# Altium project Dev_BRD_STM32F030K6T6.PrjPcb
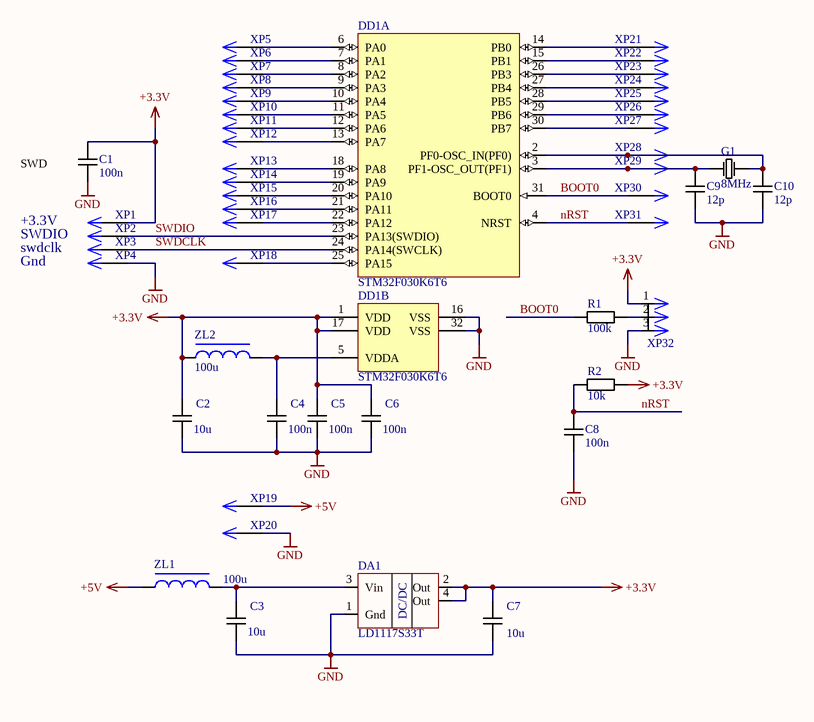
[diagram p0: Dev_BRD_STM32F030K6T6.SchDoc]
1 sheet, 49 parts. Net scope: global (net labels, ports and power ports of the same name join across sheets).
Board files: Dev_BRD_STM32F030K6T6.PcbDoc, Copy of Dev_BRD_STM32F030K6T6_ширина20.PcbDoc

## Sheet Dev_BRD_STM32F030K6T6.SchDoc
size A4 portrait

### Parts
C1  100n  [CAPC1608(0603)N]
C2  10u  [CAPC1608(0603)N]
C3  10u  [CAPC1608(0603)N]
C4  100n  [CAPC1608(0603)N]
C5  100n  [CAPC1608(0603)N]
C6  100n  [CAPC1608(0603)N]
C7  10u  [CAPC1608(0603)N]
C8  100n  [CAPC1608(0603)N]
C9  12p  [CAPC1608(0603)N]
C10  12p  [CAPC1608(0603)N]
DA1  LD1117S33T  [SOT223_M]
DD1  STM32F030K6T6  [STM-LQFP32_M]  (parts A,B of 2)
G1  8MHz  [HC-49/S]
R1  100k  [RESC1608(0603)N]
R2  10k  [RESC1608(0603)N]
XP1  PLS-1  [PLS-1-3D]  (value not drawn)
XP2  PLS-1  [PLS-1-3D]  (value not drawn)
XP3  PLS-1  [PLS-1-3D]  (value not drawn)
XP4  PLS-1  [PLS-1-3D]  (value not drawn)
XP5  PLS-1  [PLS-1-3D]  (value not drawn)
XP6  PLS-1  [PLS-1-3D]  (value not drawn)
XP7  PLS-1  [PLS-1-3D]  (value not drawn)
XP8  PLS-1  [PLS-1-3D]  (value not drawn)
XP9  PLS-1  [PLS-1-3D]  (value not drawn)
XP10  PLS-1  [PLS-1-3D]  (value not drawn)
XP11  PLS-1  [PLS-1-3D]  (value not drawn)
XP12  PLS-1  [PLS-1-3D]  (value not drawn)
XP13  PLS-1  [PLS-1-3D]  (value not drawn)
XP14  PLS-1  [PLS-1-3D]  (value not drawn)
XP15  PLS-1  [PLS-1-3D]  (value not drawn)
XP16  PLS-1  [PLS-1-3D]  (value not drawn)
XP17  PLS-1  [PLS-1-3D]  (value not drawn)
XP18  PLS-1  [PLS-1-3D]  (value not drawn)
XP19  PLS-1  [PLS-1-3D]  (value not drawn)
XP20  PLS-1  [PLS-1-3D]  (value not drawn)
XP21  PLS-1  [PLS-1-3D]  (value not drawn)
XP22  PLS-1  [PLS-1-3D]  (value not drawn)
XP23  PLS-1  [PLS-1-3D]  (value not drawn)
XP24  PLS-1  [PLS-1-3D]  (value not drawn)
XP25  PLS-1  [PLS-1-3D]  (value not drawn)
XP26  PLS-1  [PLS-1-3D]  (value not drawn)
XP27  PLS-1  [PLS-1-3D]  (value not drawn)
XP28  PLS-1  [PLS-1-3D]  (value not drawn)
XP29  PLS-1  [PLS-1-3D]  (value not drawn)
XP30  PLS-1  [PLS-1-3D]  (value not drawn)
XP31  PLS-1  [PLS-1-3D]  (value not drawn)
XP32  PLS-3  [PLS-3-3D]  (value not drawn)
ZL1  100u  [INDC1608(0603)N]
ZL2  100u  [INDC1608(0603)N]

### Nets
+3.3V: C1.1 C2.2 C5.2 C6.2 C7.2 DA1.2(Out) DA1.4(Out) DD1.1(VDD) DD1.17(VDD) R2.2 XP1.1 XP32.1 ZL2.1
+5V: XP19.1 ZL1.1
GND: C1.2 C2.1 C3.1 C4.1 C5.1 C6.1 C7.1 C8.1 C9.1 C10.1 DA1.1(Gnd) DD1.16(VSS) DD1.32(VSS) XP4.1 XP20.1 XP32.3
BOOT0: DD1.31(BOOT0) R1.1 XP30.1
nRST: C8.2 DD1.4(NRST) R2.1 XP31.1
SWDCLK: DD1.24(PA14(SWCLK)) XP3.1
SWDIO: DD1.23(PA13(SWDIO)) XP2.1
NetC3_2: C3.2 DA1.3(Vin) ZL1.2
NetC4_2: C4.2 DD1.5(VDDA) ZL2.2
NetC9_2: C9.2 DD1.3(PF1-OSC_OUT(PF1)) G1.1 XP29.1
NetC10_2: C10.2 DD1.2(PF0-OSC_IN(PF0)) G1.2 XP28.1
NetDD1_6: DD1.6(PA0) XP5.1
NetDD1_7: DD1.7(PA1) XP6.1
NetDD1_8: DD1.8(PA2) XP7.1
NetDD1_9: DD1.9(PA3) XP8.1
NetDD1_10: DD1.10(PA4) XP9.1
NetDD1_11: DD1.11(PA5) XP10.1
NetDD1_12: DD1.12(PA6) XP11.1
NetDD1_13: DD1.13(PA7) XP12.1
NetDD1_14: DD1.14(PB0) XP21.1
NetDD1_15: DD1.15(PB1) XP22.1
NetDD1_18: DD1.18(PA8) XP13.1
NetDD1_19: DD1.19(PA9) XP14.1
NetDD1_20: DD1.20(PA10) XP15.1
NetDD1_21: DD1.21(PA11) XP16.1
NetDD1_22: DD1.22(PA12) XP17.1
NetDD1_25: DD1.25(PA15) XP18.1
NetDD1_26: DD1.26(PB3) XP23.1
NetDD1_27: DD1.27(PB4) XP24.1
NetDD1_28: DD1.28(PB5) XP25.1
NetDD1_29: DD1.29(PB6) XP26.1
NetDD1_30: DD1.30(PB7) XP27.1
NetR1_2: R1.2 XP32.2

### Notes on the sheet
- (near C1) SWD
- +3.3V
- SWDIO
- swdclk
- Gnd
- (in symbol LD1117S33T) DC/DC

### Library data of the parts
C1-C10 = CAPC1608(0603): ?; Part Number: CAPC1608(0603); HelpURL: ?; Digi-Key Part Number: ?; Price$: ?; Note: ?; Manufacturer Part Number: ?; Package: ?
DA1 = LD1117S33T: LDO Voltage Regulators 3.3V 0.8A Positive; Part Number: LD1117S33T; HelpURL: http://www.mouser.com/ds/2/389/CD00000544-310772.pdf; Price$: ?; Digi-Key Part Number: ?; Note: ?; Manufacturer Part Number: ?; Package: ?
DD1 = STM32F030K6T6: ARM Microcontrollers - MCU Entry-level ARM Cortex-M0 Value MCU; FLASH Size (Prog) (kB): 32; I/Os (High Current): 26; Internal RAM Size (kB): 4; Operating Frequency(F) (Processor speed) (MHz): 48; Packing: Tray; Supply Voltage(Vcc) min (V): 2.4; DatasheetVersion: Rev. 1; PackageVersion: Rev. 1, 07/2013; PackageReference: LQFP32; PackageDescription: 32-Pin Low Profile Quad Flat Package, 7 x 7 mm Body, 0.8 mm Pitch; Supplier 1: Digi-Key; Supplier Part Number 1: 497-14046-ND; Supplier 2: Newark; Supplier Part Number 2: 19X6194; Supplier 3: Mouser; Supplier Part Number 3: 511-STM32F030K6T6; Core: ARM Cortex-M0; Mounting Technology: Surface Mount; PartNumber: STM32F030K6T6; ComponentLink1Description: Manufacturer URL; ComponentLink1URL: http://www.st.com/web/en/home.html; ComponentLink2Description: Datasheet; ComponentLink2URL: http://www.st.com/st-web-ui/static/active/en/resource/technical/document/datasheet/DM00088500.pdf; ComponentLink3Description: Package Specification; ComponentLink3URL: http://www.st.com/st-web-ui/static/active/en/resource/technical/document/datasheet/DM00088500.pdf; Part Number: STM32F030K6T6; HelpURL: https://eu.mouser.com/ProductDetail/STMicroelectronics/STM32F030K6T6?qs=eyrSuY1LhL2nYlb0JDdrAA%3D%3D; Price$: https://eu.mouser.com/ProductDetail/STMicroelectronics/STM32F030K6T6?qs=eyrSuY1LhL2nYlb0JDdrAA%3D%3D; Manufacturer Part Number: STM32F030K6T6; Package: LQFP-32; Mouser Part Number: 511-STM32F030K6T6
G1 = Crystal HC-49/S: Part Number: Crystal HC-49/S
R1 R2 = RESC1608(0603): Note: ???; Part Number: RESC1608(0603); HelpURL: ???; Digi-Key Part Number: ???; Price$: ???; Manufacturer Part Number: ???; Package: ???
XP1-XP31 = PLS-1: CONN HEADER VERT 1POS; Manufacturer Part Number: PRPC001SAAN-RC; Note: ???; Part Number: PLS-1; HelpURL: https://www.digikey.com/product-detail/en/sullins-connector-solutions/PRPC001SAAN-RC/S1011EC-01-ND/2775253; Digi-Key Part Number: S1011EC-01-ND; Price$: 0.05
XP32 = PR20203VBNN: CONN HEADER VERT 3POS 2.54MM; Part Number: PR20203VBNN; HelpURL: https://www.digikey.com/product-detail/en/metz-connect-usa-inc/PR20203VBNN/1849-1003-ND/7794768; Digi-Key Part Number: 1849-1003-ND; Manufacturer Part Number: PR20203VBNN; Package: Header 3POS 2.54mm
ZL1 ZL2 = Ferite1608(0603): ferite bead; Note: ???; Part Number: Ferite1608(0603); Digi-Key Part Number: ???; Price$: ???; Manufacturer Part Number: ???; Package: ???